# Altium schematic sheet POWER.SchDoc
size A4; SheetNumber: 4; SheetTotal: 4
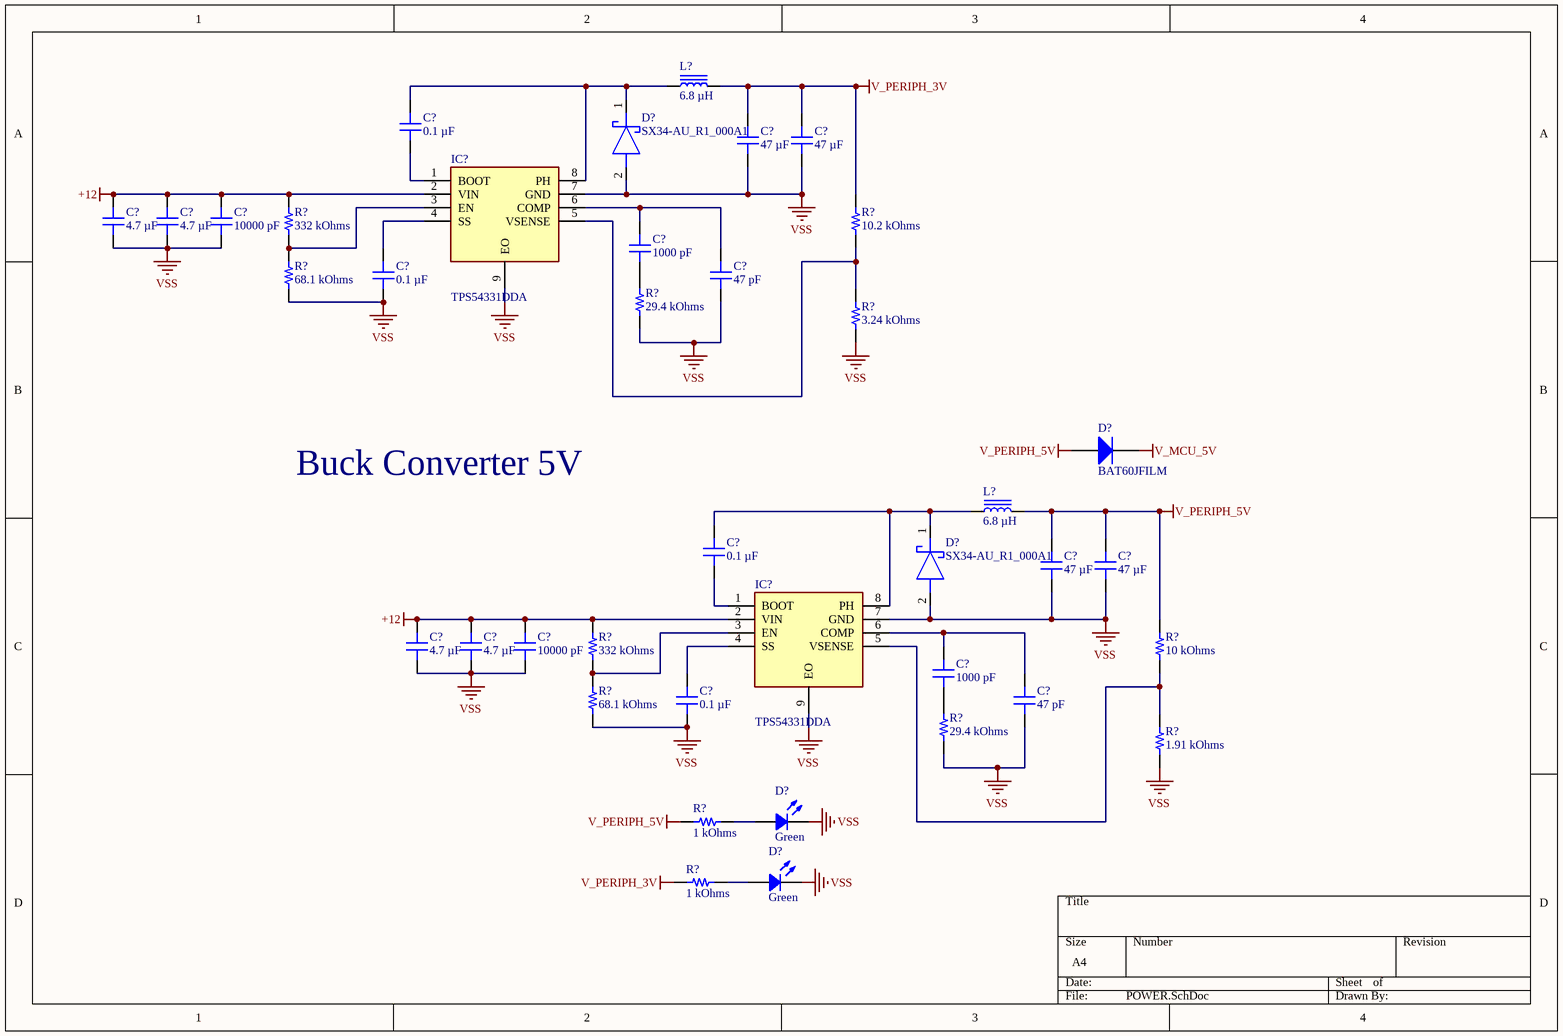
[diagram p0: POWER.SchDoc]

## Parts
(Parts that share a designator on the sheet are numbered #1, #2 ... from top to bottom, then left to right.)
C?#1  0.1 µF  [CAP 1206_3216 - 0.8MM]
C?#2  47 µF  [CAP 1206_3216 - 0.8MM]
C?#3  47 µF  [CAP 1206_3216 - 0.8MM]
C?#4  4.7 µF  [CAP 1206_3216 - 0.8MM]
C?#5  4.7 µF  [CAP 1206_3216 - 0.8MM]
C?#6  10000 pF  [CAP 1206_3216 - 0.8MM]
C?#7  1000 pF  [CAP 1206_3216 - 0.8MM]
C?#8  0.1 µF  [CAP 1206_3216 - 0.8MM]
C?#9  47 pF  [CAP 1206_3216 - 0.8MM]
C?#10  0.1 µF  [CAP 1206_3216 - 0.8MM]
C?#11  47 µF  [CAP 1206_3216 - 0.8MM]
C?#12  47 µF  [CAP 1206_3216 - 0.8MM]
C?#13  4.7 µF  [CAP 1206_3216 - 0.8MM]
C?#14  4.7 µF  [CAP 1206_3216 - 0.8MM]
C?#15  10000 pF  [CAP 1206_3216 - 0.8MM]
C?#16  1000 pF  [CAP 1206_3216 - 0.8MM]
C?#17  0.1 µF  [CAP 1206_3216 - 0.8MM]
C?#18  47 pF  [CAP 1206_3216 - 0.8MM]
D?#1  SX34-AU_R1_000A1  [DIOM5027X244N]
D?#2  BAT60JFILM  [SOD323$2F$A]
D?#3  SX34-AU_R1_000A1  [DIOM5027X244N]
D?#4  Green  [LED 0805_2012 GREEN]
D?#5  Green  [LED 0805_2012 GREEN]
IC?#1  TPS54331DDA  [SOIC127P600X170-9N]
IC?#2  TPS54331DDA  [SOIC127P600X170-9N]
L?#1  6.8 µH  [TDK SLF10165]
L?#2  6.8 µH  [TDK SLF10165]
R?#1  332 kOhms  [RES 1206_3216]
R?#2  10.2 kOhms  [RES 1206_3216]
R?#3  68.1 kOhms  [RES 1206_3216]
R?#4  29.4 kOhms  [RES 1206_3216]
R?#5  3.24 kOhms  [RES 1206_3216]
R?#6  332 kOhms  [RES 1206_3216]
R?#7  10 kOhms  [RES 1206_3216]
R?#8  68.1 kOhms  [RES 1206_3216]
R?#9  29.4 kOhms  [RES 1206_3216]
R?#10  1.91 kOhms  [RES 1206_3216]
R?#11  1 kOhms  [RES 0805_2012]
R?#12  1 kOhms  [RES 0805_2012]

## Nets
+12: C?#4.2 C?#5.2 C?#6.2 C?#13.2 C?#14.2 C?#15.2 IC?#1.2(VIN) IC?#2.2(VIN) R?#1.2 R?#6.2
V_MCU_5V: D?#2.2(K)
V_PERIPH_3V: C?#2.2 C?#3.2 L?#1.2 R?#2.2 R?#12.2
V_PERIPH_5V: C?#11.2 C?#12.2 D?#2.1(A) L?#2.2 R?#7.2 R?#11.2
VSS: C?#2.1 C?#3.1 C?#4.1 C?#5.1 C?#6.1 C?#8.1 C?#9.1 C?#11.1 C?#12.1 C?#13.1 C?#14.1 C?#15.1 C?#17.1 C?#18.1 D?#1.2(A) D?#3.2(A) D?#4.2 D?#5.2 IC?#1.7(GND) IC?#1.9(EO) IC?#2.7(GND) IC?#2.9(EO) R?#3.1 R?#4.1 R?#5.1 R?#8.1 R?#9.1 R?#10.1
NetC?#1_1: C?#1.1 IC?#1.1(BOOT)
NetC?#1_2: C?#1.2 D?#1.1(K) IC?#1.8(PH) L?#1.1
NetC?#7_1: C?#7.1 R?#4.2
NetC?#7_2: C?#7.2 C?#9.2 IC?#1.6(COMP)
NetC?#8_2: C?#8.2 IC?#1.4(SS)
NetC?#10_1: C?#10.1 IC?#2.1(BOOT)
NetC?#10_2: C?#10.2 D?#3.1(K) IC?#2.8(PH) L?#2.1
NetC?#16_1: C?#16.1 R?#9.2
NetC?#16_2: C?#16.2 C?#18.2 IC?#2.6(COMP)
NetC?#17_2: C?#17.2 IC?#2.4(SS)
NetD?#4_1: D?#4.1 R?#11.1
NetD?#5_1: D?#5.1 R?#12.1
NetIC?#1_3: IC?#1.3(EN) R?#1.1 R?#3.2
NetIC?#1_5: IC?#1.5(VSENSE) R?#2.1 R?#5.2
NetIC?#2_3: IC?#2.3(EN) R?#6.1 R?#8.2
NetIC?#2_5: IC?#2.5(VSENSE) R?#7.1 R?#10.2

## Notes on the sheet
- Buck Converter 5V

## Library data of the parts
C?#1 C?#8 C?#10 C?#17 = C1206C104K8RACTU: CAP CER 0.1UF 10V X7R 1206; manufacturer: KEMET; Tolerance: ±10%; Part Number: C1206C104K8RACTU; Capacitance: 0.1 µF; Applications: Bypass, Decoupling; componentlink1description: Datasheet; componentlink1url: https://search.kemet.com/download/datasheet/C1206C104K8RAC7800; componentlink2description: DigiKey Link; componentlink2url: https://www.digikey.com/en/products/detail/kemet/C1206C104K8RACTU/2215080; Device Package: 1206 (3216 Metric); lastupdated: 6.04.2026 7:35:59 ÖS; Lifecycle Status: Active; Minimum Order: 1; Mounting Type: Surface Mount, MLCC; Operating Temperature: -55°C ~ 125°C; Package / Case: 1206 (3216 Metric); packaging: TapeAndReel; partid: 76594; price: 0.08; series: SMD Comm X7R; Size / Dimension: 0.126" L x 0.063" W (3.20mm x 1.60mm); Supplier 1: DigiKey; Supplier Part Number 1: 399-C1206C104K8RACTUCT-ND; Temperature Coefficient: X7R; Thickness (Max): 0.035" (0.88mm); value: 0.1 µF; Voltage - Rated: 10V
C?#2 C?#3 C?#11 C?#12 = GMC31X5R476M16NT: CAP1206 X5R 47UF 20% 16V; manufacturer: Cal-Chip Electronics, Inc.; Part Number: GMC31X5R476M16NT; Capacitance: 47 µF; Applications: General Purpose; componentlink1description: Datasheet; componentlink1url: https://88ce57.p3cdn1.secureserver.net/wp-content/uploads/2023/01/gmc_series-2.pdf; componentlink2description: DigiKey Link; componentlink2url: https://www.digikey.com/en/products/detail/cal-chip-electronics-inc/GMC31X5R476M16NT/18151145; Device Package: 1206 (3216 Metric); lastupdated: 6.04.2026 7:36:39 ÖS; Lifecycle Status: Active; Minimum Order: 1; Mounting Type: Surface Mount, MLCC; Operating Temperature: -55°C ~ 85°C; Package / Case: 1206 (3216 Metric); packaging: TapeAndReel; partid: 49864; Part Status: Active; price: 0.19; series: GMC; Size / Dimension: 0.126" L x 0.063" W (3.20mm x 1.60mm); Supplier 1: DigiKey; Supplier Part Number 1: 4713-GMC31X5R476M16NTCT-ND; Temperature Coefficient: X5R; Thickness (Max): 0.071" (1.80mm); Tolerance: ±20%; value: 47 µF; Voltage - Rated: 16V
C?#4 C?#5 C?#13 C?#14 = GMC31X5R475K16NT: CAP1206 X5R 4.7UF 10% 16V; manufacturer: Cal-Chip Electronics, Inc.; Part Number: GMC31X5R475K16NT; Capacitance: 4.7 µF; Applications: General Purpose; componentlink1description: Datasheet; componentlink1url: https://calchip.com/wp-content/uploads/2025/05/GMC-Series-3.pdf; componentlink2description: DigiKey Link; componentlink2url: https://www.digikey.com/en/products/detail/cal-chip-electronics-inc/GMC31X5R475K16NT/25974971; Device Package: 1206 (3216 Metric); lastupdated: 6.04.2026 7:35:39 ÖS; Lifecycle Status: Active; Minimum Order: 1; Mounting Type: Surface Mount, MLCC; Operating Temperature: -55°C ~ 85°C; Package / Case: 1206 (3216 Metric); packaging: TapeAndReel; partid: 75053; price: 0.04; series: GMC; Size / Dimension: 0.126" L x 0.063" W (3.20mm x 1.60mm); Supplier 1: DigiKey; Supplier Part Number 1: 4713-GMC31X5R475K16NTCT-ND; Temperature Coefficient: X5R; Thickness (Max): 0.075" (1.90mm); Tolerance: ±10%; value: 4.7 µF; Voltage - Rated: 16V
C?#6 C?#15 = C1206C103J4REC7210: CAP CER 1206 10NF 16V X7R 5%; manufacturer: KEMET; Part Number: C1206C103J4REC7210; Capacitance: 10000 pF; Applications: ESD Protection; componentlink1description: Datasheet; componentlink1url: https://connect.kemet.com:7667/gateway/IntelliData-ComponentDocumentation/1.0/download/datasheet/C1206C103J4REC7210; componentlink2description: DigiKey Link; componentlink2url: https://www.digikey.com/en/products/detail/kemet/C1206C103J4REC7210/8645452; Device Package: 1206 (3216 Metric); lastupdated: 6.04.2026 7:36:20 ÖS; Lifecycle Status: Active; Minimum Order: 1; Mounting Type: Surface Mount, MLCC; Operating Temperature: -55°C ~ 125°C; Package / Case: 1206 (3216 Metric); packaging: TapeAndReel; partid: 59936; price: 0.03; series: ESD SMD Comm X7R; Size / Dimension: 0.126" L x 0.063" W (3.20mm x 1.60mm); Supplier 1: DigiKey; Supplier Part Number 1: 399-C1206C103J4REC7210CT-ND; Temperature Coefficient: X7R; Thickness (Max): 0.035" (0.88mm); Tolerance: ±5%; value: 10000 pF; Voltage - Rated: 16V
C?#7 C?#16 = GMC31CG102J50NT: CAP1206 COG 1000PF 5% 50V; manufacturer: Cal-Chip Electronics, Inc.; Temperature Coefficient: C0G, NP0; Part Number: GMC31CG102J50NT; Capacitance: 1000 pF; Applications: General Purpose; componentlink2description: DigiKey Link; componentlink2url: https://www.digikey.com/en/products/detail/cal-chip-electronics-inc/GMC31CG102J50NT/25893179; Device Package: 1206 (3216 Metric); lastupdated: 6.04.2026 7:35:48 ÖS; Lifecycle Status: Active; Minimum Order: 1; Mounting Type: Surface Mount, MLCC; Operating Temperature: -55°C ~ 125°C; Package / Case: 1206 (3216 Metric); packaging: TapeAndReel; partid: 75870; price: 0.03; series: GMC; Size / Dimension: 0.126" L x 0.063" W (3.20mm x 1.60mm); Supplier 1: DigiKey; Supplier Part Number 1: 4713-GMC31CG102J50NTCT-ND; Thickness (Max): 0.039" (1.00mm); Tolerance: ±5%; value: 1000 pF; Voltage - Rated: 50V
C?#9 C?#18 = GMC31CG470J50NT: CAP1206 COG 47PF 5% 50V; manufacturer: Cal-Chip Electronics, Inc.; Temperature Coefficient: C0G, NP0; Part Number: GMC31CG470J50NT; Capacitance: 47 pF; Applications: General Purpose; componentlink1description: Datasheet; componentlink1url: https://calchip.com/wp-content/uploads/2025/05/GMC-Series-3.pdf; componentlink2description: DigiKey Link; componentlink2url: https://www.digikey.com/en/products/detail/cal-chip-electronics-inc/GMC31CG470J50NT/25951912; Device Package: 1206 (3216 Metric); lastupdated: 6.04.2026 7:35:45 ÖS; Lifecycle Status: Active; Minimum Order: 1; Mounting Type: Surface Mount, MLCC; Operating Temperature: -55°C ~ 125°C; Package / Case: 1206 (3216 Metric); packaging: TapeAndReel; partid: 75679; price: 0.02; series: GMC; Size / Dimension: 0.126" L x 0.063" W (3.20mm x 1.60mm); Supplier 1: DigiKey; Supplier Part Number 1: 4713-GMC31CG470J50NTCT-ND; Thickness (Max): 0.035" (0.90mm); Tolerance: ±5%; value: 47 pF; Voltage - Rated: 50V
D?#1 D?#3 = SX34-AU_R1_000A1: Schottky Diode; Manufacturer_Name: PANJIT; Datasheet Link: https://www.digikey.ph/en/products/detail/panjit-international-inc/SX34-AU-R1-000A1/14660431; Height: 2.44mm; Manufacturer_Part_Number: SX34-AU_R1_000A1; Mouser Part Number: 241-SX34-AU_R1_000A1; Mouser Price/Stock: https://www.mouser.co.uk/ProductDetail/Panjit/SX34-AU_R1_000A1?qs=sPbYRqrBIVmPx5DmdP6VTw%3D%3D
D?#2 = BAT60JFILM: Manuf_1: STM; Code - JEDEC: DO-214-AB; Provided: ST; Published: 8-Jun-2000; Revision: July-2002: Re-released for DXP Platform.; Publisher: Altium Limited; Order: BAT60JFILM; Manuf_Part_1: BAT60JFILM
D?#4 D?#5 = QTLP630C4TR: LED GREEN CLEAR 0805 SMD; Manufacturer: Everlight Electronics Co Ltd; Configuration: Standard; Current - Test: 20mA; Lens Color: Colorless; Lens Size: 1.40mm x 1.25mm; Lens Style: Rectangle with Flat Top; Millicandela Rating: 10mcd; Viewing Angle: 140°; Voltage - Forward (Vf) (Typ): 2.1V; Wavelength - Dominant: 570nm; Wavelength - Peak: 565nm; Part Number: QTLP630C4TR; Color: Green; ComponentLink1Description: Datasheet; ComponentLink1URL: //media.digikey.com/PDF/Data%20Sheets/Everlight%20PDFs/QTLP630-2.pdf; ComponentLink2Description: DigiKey Link; ComponentLink2URL: https://www.digikey.com/en/products/detail/everlight-electronics-co-ltd/QTLP630C4TR/2675902; Device Package: 0805 (2012 Metric); Height (Max): 1.20mm; LastUpdated: 3.06.2024 8:00:30 ÖS; Lens Transparency: Clear; Lifecycle Status: Active; Minimum Order: 1; Mounting Type: Surface Mount; Package / Case: 0805 (2012 Metric); Packaging: TapeAndReel; PartId: 240; Part Status: Active; Price: 0.05; Series: -; Size / Dimension: 2.00mm L x 1.25mm W; Supplier 1: DigiKey; Supplier Part Number 1: 1080-1411-1-ND; Supplier Device Package: 0805; Value: Green
IC?#1 IC?#2 = TPS54331DDA: Integrated Circuit; Manufacturer_Name: Texas Instruments; Datasheet Link: http://www.ti.com/lit/gpn/TPS54331; Height: 1.7mm; Manufacturer_Part_Number: TPS54331DDA; Mouser Part Number: 595-TPS54331DDA; Mouser Price/Stock: https://www.mouser.co.uk/ProductDetail/Texas-Instruments/TPS54331DDA?qs=mNuCSSXMdBzo%2FVuLCE1BuQ%3D%3D; Arrow Part Number: TPS54331DDA; Arrow Price/Stock: https://www.arrow.com/en/products/tps54331dda/texas-instruments.html?utm_currency=USD&region=nac
L?#1 L?#2 = SLF10165T-6R8N4R33PF: FIXED IND 6.8UH 4.3A 18.2MOHM SM; Manufacturer: TDK Corporation; Current - Saturation: 4.6A; DC Resistance (DCR): 18.2mOhm Max; Inductance Frequency - Test: 100 kHz; Material - Core: Ferrite; Shielding: Shielded; Tolerance: ±30%; Type: Drum Core, Wirewound; Part Number: SLF10165T-6R8N4R33PF; ComponentLink1Description: Datasheet; ComponentLink1URL: https://product.tdk.com/info/en/catalog/datasheets/inductor_commercial_power_slf10165_en.pdf?ref_disty=digikey; ComponentLink2Description: DigiKey Link; ComponentLink2URL: https://www.digikey.com/en/products/detail/tdk-corporation/SLF10165T-6R8N4R33PF/2465241; Current Rating (Amps): 4.3 A; Device Package: Nonstandard; Height - Seated (Max): 0.268" (6.80mm); Inductance: 6.8 µH; LastUpdated: 12.07.2023 8:19:32 ÖS; Lifecycle Status: Active; Minimum Order: 1; Mounting Type: Surface Mount; Operating Temperature: -40°C ~ 105°C; Package / Case: Nonstandard; Packaging: TapeAndReel; PartId: 95; Part Status: Active; Price: 0.48; Series: SLF; Size / Dimension: 0.398" L x 0.398" W (10.10mm x 10.10mm); Supplier 1: DigiKey; Supplier Part Number 1: 445-6484-1-ND; Value: 6.8 µH
R?#1 R?#6 = TNPW1206332KBEEA: RES 332K OHM 0.1% 0.52W 1206; Manufacturer: Vishay Dale; Temperature Coefficient: ±25ppm/°C; Part Number: TNPW1206332KBEEA; ComponentLink1Description: Datasheet; ComponentLink1URL: http://www.vishay.com/docs/28758/tnpw_e3.pdf; ComponentLink2Description: DigiKey Link; ComponentLink2URL: https://www.digikey.com/en/products/detail/vishay-dale/TNPW1206332KBEEA/1608139; Composition: Thin Film; Device Package: 1206 (3216 Metric); Features: Anti-Sulfur, Automotive AEC-Q200, Moisture Resistant; Height - Seated (Max): 0.026" (0.65mm); LastUpdated: 6.04.2026 8:00:10 ÖS; Lifecycle Status: Active; Minimum Order: 1; Number of Terminations: 2; Operating Temperature: -55°C ~ 175°C; Package / Case: 1206 (3216 Metric); Packaging: TapeAndReel; PartId: 35136; Part Status: Active; Power (Watts): 0.52W; Price: 0.19; Ratings: AEC-Q200; Resistance: 332 kOhms; Series: TNPW e3; Size / Dimension: 0.126" L x 0.063" W (3.20mm x 1.60mm); Supplier 1: DigiKey; Supplier Part Number 1: 541-3235-1-ND; Supplier Device Package: 1206; Tolerance: ±0.1%; Value: 332 kOhms
R?#2 = RC1206FR-0710K2L: RES 10.2K OHM 1% 1/4W 1206; Manufacturer: Yageo; Power (Watts): 0.25W, 1/4W; Temperature Coefficient: ±100ppm/°C; Part Number: RC1206FR-0710K2L; ComponentLink1Description: Datasheet; ComponentLink1URL: https://www.yageo.com/upload/media/product/productsearch/datasheet/rchip/PYu-RC_Group_51_RoHS_L_10.pdf; ComponentLink2Description: DigiKey Link; ComponentLink2URL: https://www.digikey.com/en/products/detail/yageo/RC1206FR-0710K2L/728486; Composition: Thick Film; Device Package: 1206 (3216 Metric); Features: Moisture Resistant; Height - Seated (Max): 0.026" (0.65mm); LastUpdated: 6.04.2026 8:00:25 ÖS; Lifecycle Status: Active; Minimum Order: 1; Number of Terminations: 2; Operating Temperature: -55°C ~ 155°C; Package / Case: 1206 (3216 Metric); Packaging: TapeAndReel; PartId: 32370; Part Status: Active; Price: 0.01; Resistance: 10.2 kOhms; Series: RC_L; Size / Dimension: 0.122" L x 0.063" W (3.10mm x 1.60mm); Supplier 1: DigiKey; Supplier Part Number 1: 311-10.2KFRCT-ND; Supplier Device Package: 1206; Tolerance: ±1%; Value: 10.2 kOhms
R?#3 R?#8 = TNPW120668K1BEEN: RES 68.1K OHM 0.1% 0.52W 1206; Manufacturer: Vishay Dale; Temperature Coefficient: ±25ppm/°C; Part Number: TNPW120668K1BEEN; ComponentLink1Description: Datasheet; ComponentLink1URL: http://www.vishay.com/docs/28758/tnpw_e3.pdf; ComponentLink2Description: DigiKey Link; ComponentLink2URL: https://www.digikey.com/en/products/detail/vishay-dale/TNPW120668K1BEEN/1611271; Composition: Thin Film; Device Package: 1206 (3216 Metric); Features: Anti-Sulfur, Automotive AEC-Q200, Moisture Resistant; Height - Seated (Max): 0.026" (0.65mm); LastUpdated: 6.04.2026 8:00:01 ÖS; Lifecycle Status: Active; Minimum Order: 1; Number of Terminations: 2; Operating Temperature: -55°C ~ 175°C; Package / Case: 1206 (3216 Metric); Packaging: TapeAndReel; PartId: 36984; Part Status: Active; Power (Watts): 0.52W; Price: 0.30; Ratings: AEC-Q200; Resistance: 68.1 kOhms; Series: TNPW e3; Size / Dimension: 0.126" L x 0.063" W (3.20mm x 1.60mm); Supplier 1: DigiKey; Supplier Part Number 1: 541-3887-1-ND; Supplier Device Package: 1206; Tolerance: ±0.1%; Value: 68.1 kOhms
R?#4 R?#9 = TNPW120629K4BEEN: RES 29.4K OHM 0.1% 0.52W 1206; Manufacturer: Vishay Dale; Temperature Coefficient: ±25ppm/°C; Part Number: TNPW120629K4BEEN; ComponentLink1Description: Datasheet; ComponentLink1URL: https://www.vishay.com/docs/28758/tnpw_e3.pdf; ComponentLink2Description: DigiKey Link; ComponentLink2URL: https://www.digikey.com/en/products/detail/vishay-dale/TNPW120629K4BEEN/1611226; Composition: Thin Film; Device Package: 1206 (3216 Metric); Features: Anti-Sulfur, Automotive AEC-Q200, Moisture Resistant; Height - Seated (Max): 0.026" (0.65mm); LastUpdated: 6.04.2026 7:56:48 ÖS; Lifecycle Status: Active; Minimum Order: 1; Number of Terminations: 2; Operating Temperature: -55°C ~ 175°C; Package / Case: 1206 (3216 Metric); Packaging: TapeAndReel; PartId: 91490; Power (Watts): 0.52W; Price: 0.30; Ratings: AEC-Q200; Resistance: 29.4 kOhms; Series: TNPW e3; Size / Dimension: 0.126" L x 0.063" W (3.20mm x 1.60mm); Supplier 1: DigiKey; Supplier Part Number 1: 541-TNPW120629K4BEENCT-ND; Supplier Device Package: 1206; Tolerance: ±0.1%; Value: 29.4 kOhms
R?#5 = 3503G2B3K24FTD: RES 3.24K OHM 1% 2W 1206; Manufacturer: TE Connectivity Passive Product; Temperature Coefficient: ±50ppm/°C; Part Number: 3503G2B3K24FTD; ComponentLink1Description: Datasheet; ComponentLink1URL: https://www.te.com/commerce/DocumentDelivery/DDEController?Action=showdoc&DocId=Customer+Drawing%7F2176527%7FA%7Fpdf%7FEnglish%7FENG_CD_2176527_A.pdf%7F7-2176527-5; ComponentLink2Description: DigiKey Link; ComponentLink2URL: https://www.digikey.com/en/products/detail/te-connectivity-passive-product/3503G2B3K24FTD/16808892; Composition: Thin Film; Device Package: 1206 (3216 Metric); Height - Seated (Max): 0.023" (0.58mm); LastUpdated: 6.04.2026 7:58:43 ÖS; Lifecycle Status: Active; Minimum Order: 1; Number of Terminations: 2; Operating Temperature: -55°C ~ 155°C; Package / Case: 1206 (3216 Metric); Packaging: TapeAndReel; PartId: 72203; Part Status: Active; Power (Watts): 2W; Price: 0.46; Resistance: 3.24 kOhms; Series: 3503; Size / Dimension: 0.120" L x 0.061" W (3.05mm x 1.55mm); Supplier 1: DigiKey; Supplier Part Number 1: 1712-3503G2B3K24FTDCT-ND; Supplier Device Package: 1206; Tolerance: ±1%; Value: 3.24 kOhms
R?#7 = RS73F2BTTD1002B: RES 10K OHM 0.1% 1/3W 1206; Manufacturer: KOA Speer Electronics, Inc.; Power (Watts): 0.333W, 1/3W; Temperature Coefficient: ±25ppm/°C; Part Number: RS73F2BTTD1002B; ComponentLink1Description: Datasheet; ComponentLink1URL: https://www.koaspeer.com/pdfs/RS73.pdf; ComponentLink2Description: DigiKey Link; ComponentLink2URL: https://www.digikey.com/en/products/detail/koa-speer-electronics-inc/RS73F2BTTD1002B/11583082; Composition: Thick Film; Device Package: 1206 (3216 Metric); Features: Automotive AEC-Q200, Moisture Resistant; Height - Seated (Max): 0.028" (0.70mm); LastUpdated: 6.04.2026 7:57:45 ÖS; Lifecycle Status: Active; Minimum Order: 1; Number of Terminations: 2; Operating Temperature: -55°C ~ 155°C; Package / Case: 1206 (3216 Metric); Packaging: TapeAndReel; PartId: 84095; Price: 0.12; Ratings: AEC-Q200; Resistance: 10 kOhms; Series: RS73; Size / Dimension: 0.126" L x 0.063" W (3.20mm x 1.60mm); Supplier 1: DigiKey; Supplier Part Number 1: 2019-RS73F2BTTD1002BCT-ND; Supplier Device Package: 1206; Tolerance: ±0.1%; Value: 10 kOhms
R?#10 = 3503G2B1K91FTD: RES 1.91K OHM 1% 2W 1206; Manufacturer: TE Connectivity Passive Product; Temperature Coefficient: ±50ppm/°C; Part Number: 3503G2B1K91FTD; ComponentLink1Description: Datasheet; ComponentLink1URL: https://www.te.com/commerce/DocumentDelivery/DDEController?Action=showdoc&DocId=Customer+Drawing%7F2176527%7FA%7Fpdf%7FEnglish%7FENG_CD_2176527_A.pdf%7F5-2176527-3; ComponentLink2Description: DigiKey Link; ComponentLink2URL: https://www.digikey.com/en/products/detail/te-connectivity-passive-product/3503G2B1K91FTD/16808641; Composition: Thin Film; Device Package: 1206 (3216 Metric); Height - Seated (Max): 0.023" (0.58mm); LastUpdated: 6.04.2026 7:58:43 ÖS; Lifecycle Status: Active; Minimum Order: 1; Number of Terminations: 2; Operating Temperature: -55°C ~ 155°C; Package / Case: 1206 (3216 Metric); Packaging: TapeAndReel; PartId: 72209; Part Status: Active; Power (Watts): 2W; Price: 0.46; Resistance: 1.91 kOhms; Series: 3503; Size / Dimension: 0.120" L x 0.061" W (3.05mm x 1.55mm); Supplier 1: DigiKey; Supplier Part Number 1: 1712-3503G2B1K91FTDCT-ND; Supplier Device Package: 1206; Tolerance: ±1%; Value: 1.91 kOhms
R?#11 R?#12 = RCA08051K00FKEAHP: RES 1K OHM 1% 1/2W 0805; Manufacturer: Vishay Dale; Power (Watts): 0.5W, 1/2W; Temperature Coefficient: ±100ppm/°C; Part Number: RCA08051K00FKEAHP; Value: 1 kOhms; ComponentLink1Description: Datasheet; ComponentLink1URL: http://www.vishay.com/docs/20067/rcahp.pdf; ComponentLink2Description: DigiKey Link; ComponentLink2URL: https://www.digikey.com/en/products/detail/vishay-dale/RCA08051K00FKEAHP/6561246; Composition: Thick Film; Device Package: 0805 (2012 Metric); Features: Anti-Sulfur, Automotive AEC-Q200, Pulse Withstanding; Height - Seated (Max): 0.024" (0.60mm); LastUpdated: 5.04.2026 8:10:05 ÖS; Lifecycle Status: Active; Minimum Order: 1; Number of Terminations: 2; Operating Temperature: -55°C ~ 155°C; Package / Case: 0805 (2012 Metric); Packaging: TapeAndReel; PartId: 45382; Part Status: Active; Price: 0.03; Ratings: AEC-Q200; Resistance: 1 kOhms; Series: RCA-HP; Size / Dimension: 0.079" L x 0.049" W (2.00mm x 1.25mm); Supplier 1: DigiKey; Supplier Part Number 1: 541-3249-1-ND; Supplier Device Package: 0805; Tolerance: ±1%